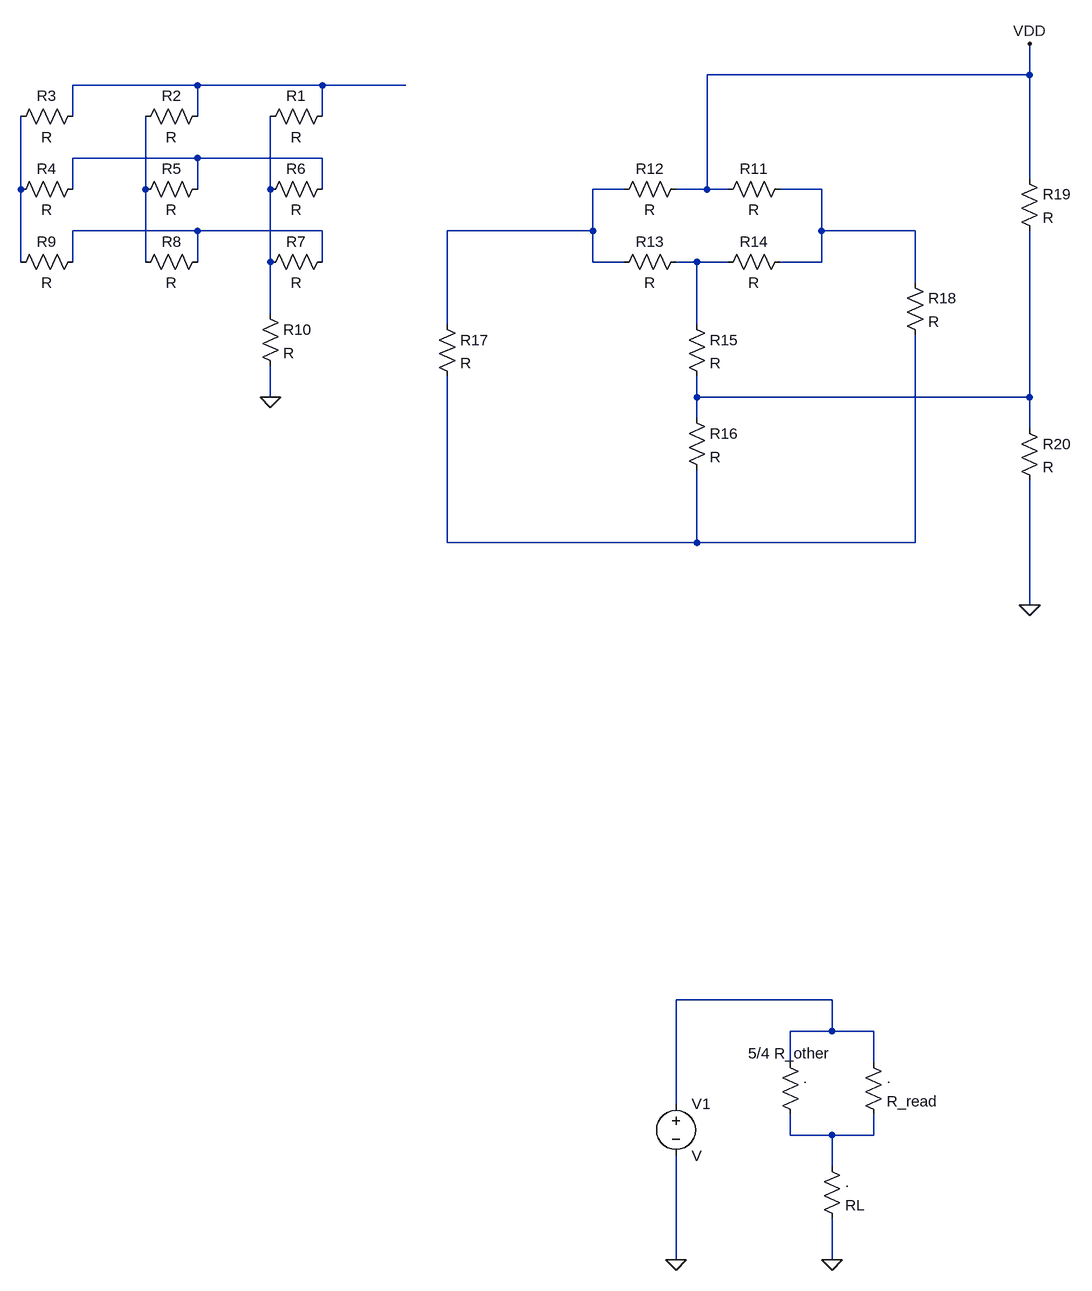
[diagram p0: schematic Draft2.asc]
Draft2.asc, the LTspice schematic file:
Version 4
SHEET 1 1444 1924
WIRE 1376 80 1376 32
WIRE 1376 80 880 80
WIRE 96 96 -96 96
WIRE 288 96 96 96
WIRE 416 96 288 96
WIRE -96 144 -96 96
WIRE 96 144 96 96
WIRE 288 144 288 96
WIRE 96 208 -96 208
WIRE 288 208 96 208
WIRE 1376 240 1376 80
WIRE -176 256 -176 144
WIRE -96 256 -96 208
WIRE 16 256 16 144
WIRE 96 256 96 208
WIRE 208 256 208 144
WIRE 288 256 288 208
WIRE 752 256 704 256
WIRE 880 256 880 80
WIRE 880 256 832 256
WIRE 912 256 880 256
WIRE 1056 256 992 256
WIRE 96 320 -96 320
WIRE 288 320 96 320
WIRE 704 320 704 256
WIRE 704 320 480 320
WIRE 1056 320 1056 256
WIRE 1200 320 1056 320
WIRE -176 368 -176 256
WIRE -96 368 -96 320
WIRE 16 368 16 256
WIRE 96 368 96 320
WIRE 208 368 208 256
WIRE 288 368 288 320
WIRE 704 368 704 320
WIRE 752 368 704 368
WIRE 864 368 832 368
WIRE 912 368 864 368
WIRE 1056 368 1056 320
WIRE 1056 368 992 368
WIRE 1200 400 1200 320
WIRE 208 448 208 368
WIRE 480 464 480 320
WIRE 864 464 864 368
WIRE 208 576 208 528
WIRE 864 576 864 544
WIRE 1376 576 1376 320
WIRE 1376 576 864 576
WIRE 864 608 864 576
WIRE 1376 624 1376 576
WIRE 480 800 480 544
WIRE 864 800 864 688
WIRE 864 800 480 800
WIRE 1200 800 1200 480
WIRE 1200 800 864 800
WIRE 1376 896 1376 704
WIRE 1072 1504 832 1504
WIRE 1072 1552 1072 1504
WIRE 1072 1552 1008 1552
WIRE 1136 1552 1072 1552
WIRE 1008 1600 1008 1552
WIRE 1136 1600 1136 1552
WIRE 832 1664 832 1504
WIRE 1008 1712 1008 1680
WIRE 1072 1712 1008 1712
WIRE 1136 1712 1136 1680
WIRE 1136 1712 1072 1712
WIRE 1072 1760 1072 1712
WIRE 832 1904 832 1744
WIRE 1072 1904 1072 1840
FLAG 208 576 0
FLAG 1376 896 0
FLAG 1376 32 VDD
FLAG 1072 1904 0
FLAG 832 1904 0
SYMBOL res 304 128 R90
WINDOW 0 0 56 VBottom 2
WINDOW 3 32 56 VTop 2
SYMATTR InstName R1
SYMBOL res 112 128 R90
WINDOW 0 0 56 VBottom 2
WINDOW 3 32 56 VTop 2
SYMATTR InstName R2
SYMBOL res -80 128 R90
WINDOW 0 0 56 VBottom 2
WINDOW 3 32 56 VTop 2
SYMATTR InstName R3
SYMBOL res -80 240 R90
WINDOW 0 0 56 VBottom 2
WINDOW 3 32 56 VTop 2
SYMATTR InstName R4
SYMBOL res 112 240 R90
WINDOW 0 0 56 VBottom 2
WINDOW 3 32 56 VTop 2
SYMATTR InstName R5
SYMBOL res 304 240 R90
WINDOW 0 0 56 VBottom 2
WINDOW 3 32 56 VTop 2
SYMATTR InstName R6
SYMBOL res 304 352 R90
WINDOW 0 0 56 VBottom 2
WINDOW 3 32 56 VTop 2
SYMATTR InstName R7
SYMBOL res 112 352 R90
WINDOW 0 0 56 VBottom 2
WINDOW 3 32 56 VTop 2
SYMATTR InstName R8
SYMBOL res -80 352 R90
WINDOW 0 0 56 VBottom 2
WINDOW 3 32 56 VTop 2
SYMATTR InstName R9
SYMBOL res 192 432 R0
SYMATTR InstName R10
SYMBOL res 1008 240 R90
WINDOW 0 0 56 VBottom 2
WINDOW 3 32 56 VTop 2
SYMATTR InstName R11
SYMBOL res 848 240 R90
WINDOW 0 0 56 VBottom 2
WINDOW 3 32 56 VTop 2
SYMATTR InstName R12
SYMBOL res 848 352 R90
WINDOW 0 0 56 VBottom 2
WINDOW 3 32 56 VTop 2
SYMATTR InstName R13
SYMBOL res 1008 352 R90
WINDOW 0 0 56 VBottom 2
WINDOW 3 32 56 VTop 2
SYMATTR InstName R14
SYMBOL res 848 448 R0
SYMATTR InstName R15
SYMBOL res 848 592 R0
SYMATTR InstName R16
SYMBOL res 464 448 R0
SYMATTR InstName R17
SYMBOL res 1184 384 R0
SYMATTR InstName R18
SYMBOL res 1360 224 R0
SYMATTR InstName R19
SYMBOL res 1360 608 R0
SYMATTR InstName R20
SYMBOL res 1120 1584 R0
SYMATTR InstName .
SYMATTR Value R_read
SYMBOL res 1056 1744 R0
SYMATTR InstName .
SYMATTR Value RL
SYMBOL res 992 1584 R0
WINDOW 3 -49 2 Left 2
SYMATTR InstName .
SYMATTR Value 5/4 R_other
SYMBOL voltage 832 1648 R0
SYMATTR InstName V1

The netlist it stands for:
* Draft2.asc
R1 N001 N005 R
R2 N001 N004 R
R3 N001 N003 R
R4 N002 N003 R
R5 N002 N004 R
R6 N002 N005 R
R7 N008 N005 R
R8 N008 N004 R
R9 N008 N003 R
R10 N005 0 R
R11 N007 VDD R
R12 VDD N006 R
R13 N009 N006 R
R14 N007 N009 R
R15 N009 N010 R
R16 N010 N011 R
R17 N006 N011 R
R18 N007 N011 R
R19 VDD N010 R
R20 N010 0 R
R§. N012 N013 R_read
R§. N013 0 RL
R§. N012 N013 5/4 R_other
V1 N012 0 V
.backanno
.end